# Altium schematic sheet ZYNQ_SOC_FPGA.SchDoc
size A4
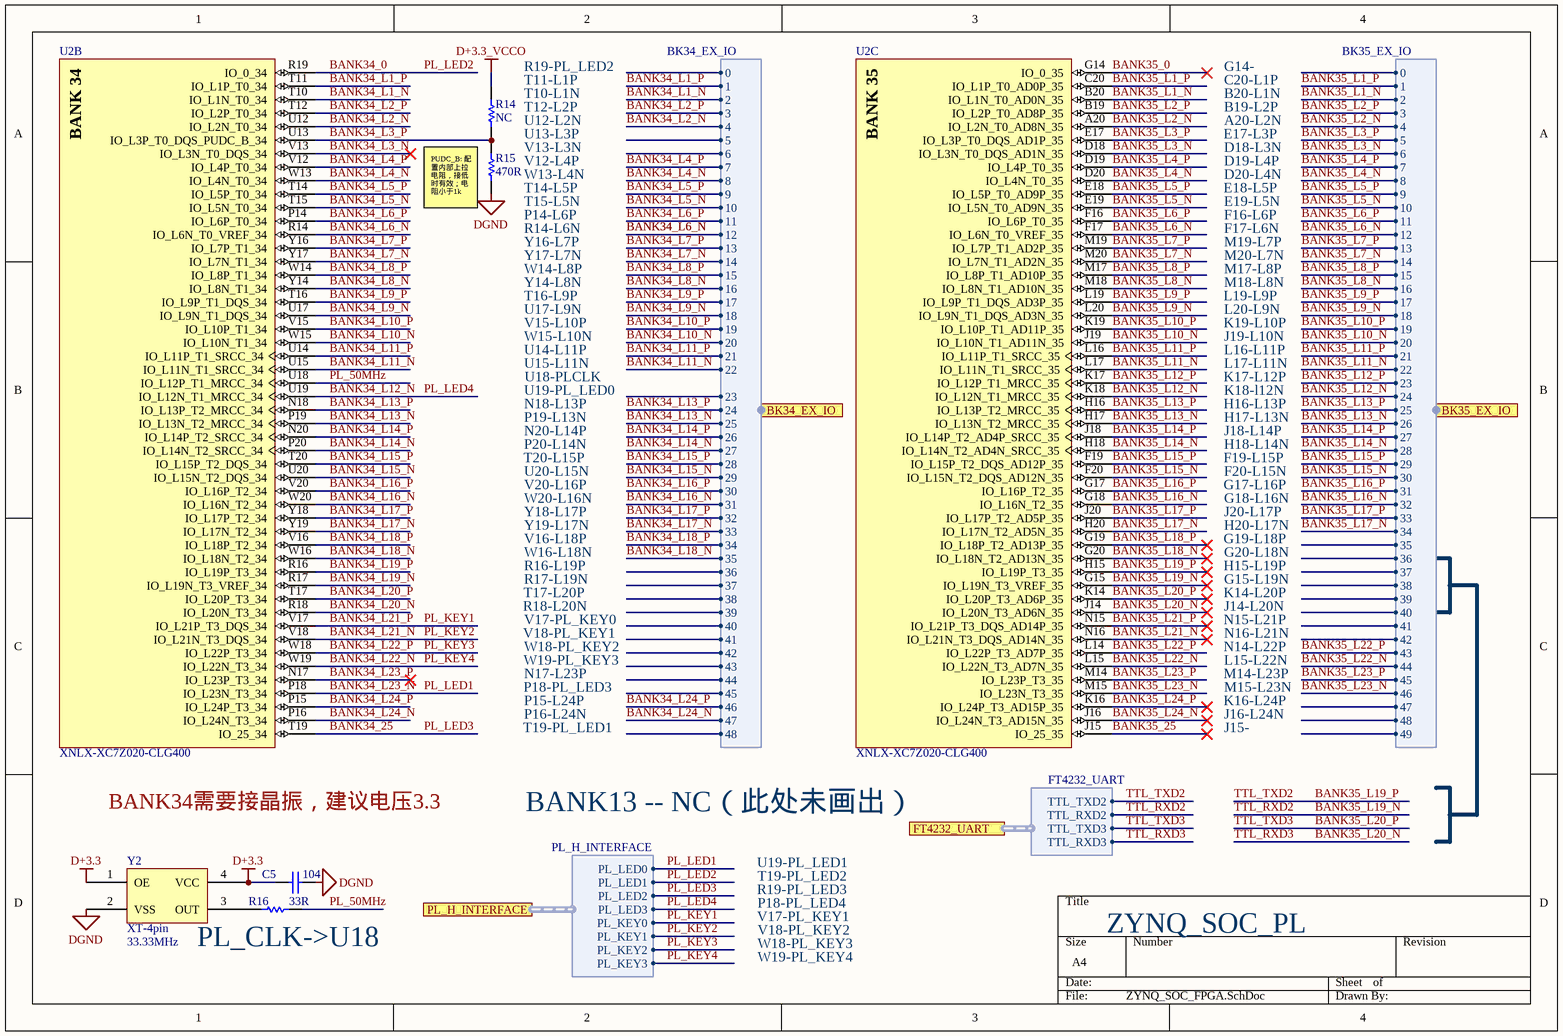
[diagram p0: ZYNQ_SOC_FPGA.SchDoc]

## Parts
C5  104  [C 0402_LL]
R14  NC  [R 0402_L]
R15  470R  [R 0402_L]
R16  33R  [R 0603_L]
U2  XNLX-XC7Z020-CLG400  [BGA400]  (parts B,C of 9)
Y2  XT-4pin  value 33.33MHz  [5032(P)]

## Ports
BK34_EX_IO (harness BK34_EX_IO), BK35_EX_IO (harness BK35_EX_IO), FT4232_UART (harness FT4232_UART), PL_H_INTERFACE (harness PL_H_INTERFACE)

## Harnesses
BK35_EX_IO: 0, 1, 2, 3, 4, 5, 6, 7, 8, 9, 10, 11, 12, 13, 14, 15, 16, 17, 18, 19, 20, 21, 22, 23, 24, 25, 26, 27, 28, 29, 30, 31, 32, 33, 34, 35, 36, 37, 38, 39, 40, 41, 42, 43, 44, 45, 46, 47, 48, 49
BK34_EX_IO: 0, 1, 2, 3, 4, 5, 6, 7, 8, 9, 10, 11, 12, 13, 14, 15, 16, 17, 18, 19, 20, 21, 22, 23, 24, 25, 26, 27, 28, 29, 30, 31, 32, 33, 34, 35, 36, 37, 38, 39, 40, 41, 42, 43, 44, 45, 46, 47, 48
PL_H_INTERFACE: PL_LED0, PL_LED1, PL_KEY0, PL_KEY1, PL_LED2, PL_LED3, PL_KEY2, PL_KEY3
FT4232_UART: TTL_TXD2, TTL_RXD2, TTL_RXD3, TTL_TXD3

## Nets
D+3.3: C5.1 Y2.1(OE) Y2.4(VCC)
D+3.3_VCCO: R14.2
DGND: C5.2 R15.1 Y2.2(VSS)
BANK34_0: U2.R19(IO_0_34) ; port PL_H_INTERFACE.PL_LED1  [also labelled PL_LED2]
BANK34_25: U2.T19(IO_25_34) ; port PL_H_INTERFACE.PL_LED2  [also labelled PL_LED3]
BANK34_L1_N: U2.T10(IO_L1N_T0_34) ; port BK34_EX_IO.2
BANK34_L1_P: U2.T11(IO_L1P_T0_34) ; port BK34_EX_IO.1
BANK34_L2_N: U2.U12(IO_L2N_T0_34) ; port BK34_EX_IO.4
BANK34_L2_P: U2.T12(IO_L2P_T0_34) ; port BK34_EX_IO.3
BANK34_L3_N: U2.V13(IO_L3N_T0_DQS_34)
BANK34_L3_P: R14.1 R15.2 U2.U13(IO_L3P_T0_DQS_PUDC_B_34)
BANK34_L4_N: U2.W13(IO_L4N_T0_34) ; port BK34_EX_IO.8
BANK34_L4_P: U2.V12(IO_L4P_T0_34) ; port BK34_EX_IO.7
BANK34_L5_N: U2.T15(IO_L5N_T0_34) ; port BK34_EX_IO.10
BANK34_L5_P: U2.T14(IO_L5P_T0_34) ; port BK34_EX_IO.9
BANK34_L6_N: U2.R14(IO_L6N_T0_VREF_34) ; port BK34_EX_IO.12
BANK34_L6_P: U2.P14(IO_L6P_T0_34) ; port BK34_EX_IO.11
BANK34_L7_N: U2.Y17(IO_L7N_T1_34) ; port BK34_EX_IO.14
BANK34_L7_P: U2.Y16(IO_L7P_T1_34) ; port BK34_EX_IO.13
BANK34_L8_N: U2.Y14(IO_L8N_T1_34) ; port BK34_EX_IO.16
BANK34_L8_P: U2.W14(IO_L8P_T1_34) ; port BK34_EX_IO.15
BANK34_L9_N: U2.U17(IO_L9N_T1_DQS_34) ; port BK34_EX_IO.18
BANK34_L9_P: U2.T16(IO_L9P_T1_DQS_34) ; port BK34_EX_IO.17
BANK34_L10_N: U2.W15(IO_L10N_T1_34) ; port BK34_EX_IO.20
BANK34_L10_P: U2.V15(IO_L10P_T1_34) ; port BK34_EX_IO.19
BANK34_L11_N: U2.U15(IO_L11N_T1_SRCC_34) ; port BK34_EX_IO.22
BANK34_L11_P: U2.U14(IO_L11P_T1_SRCC_34) ; port BK34_EX_IO.21
BANK34_L12_N: U2.U19(IO_L12N_T1_MRCC_34) ; port PL_H_INTERFACE.PL_LED3  [also labelled PL_LED4]
BANK34_L13_N: U2.P19(IO_L13N_T2_MRCC_34) ; port BK34_EX_IO.25
BANK34_L13_P: U2.N18(IO_L13P_T2_MRCC_34) ; port BK34_EX_IO.24
BANK34_L14_N: U2.P20(IO_L14N_T2_SRCC_34) ; port BK34_EX_IO.27
BANK34_L14_P: U2.N20(IO_L14P_T2_SRCC_34) ; port BK34_EX_IO.26
BANK34_L15_N: U2.U20(IO_L15N_T2_DQS_34) ; port BK34_EX_IO.29
BANK34_L15_P: U2.T20(IO_L15P_T2_DQS_34) ; port BK34_EX_IO.28
BANK34_L16_N: U2.W20(IO_L16N_T2_34) ; port BK34_EX_IO.31
BANK34_L16_P: U2.V20(IO_L16P_T2_34) ; port BK34_EX_IO.30
BANK34_L17_N: U2.Y19(IO_L17N_T2_34) ; port BK34_EX_IO.33
BANK34_L17_P: U2.Y18(IO_L17P_T2_34) ; port BK34_EX_IO.32
BANK34_L18_N: U2.W16(IO_L18N_T2_34) ; port BK34_EX_IO.35
BANK34_L18_P: U2.V16(IO_L18P_T2_34) ; port BK34_EX_IO.34
BANK34_L19_N: U2.R17(IO_L19N_T3_VREF_34)
BANK34_L19_P: U2.R16(IO_L19P_T3_34)
BANK34_L20_N: U2.R18(IO_L20N_T3_34)
BANK34_L20_P: U2.T17(IO_L20P_T3_34)
BANK34_L21_N: U2.V18(IO_L21N_T3_DQS_34) ; port PL_H_INTERFACE.PL_KEY1  [also labelled PL_KEY2]
BANK34_L21_P: U2.V17(IO_L21P_T3_DQS_34) ; port PL_H_INTERFACE.PL_KEY0  [also labelled PL_KEY1]
BANK34_L22_N: U2.W19(IO_L22N_T3_34) ; port PL_H_INTERFACE.PL_KEY3  [also labelled PL_KEY4]
BANK34_L22_P: U2.W18(IO_L22P_T3_34) ; port PL_H_INTERFACE.PL_KEY2  [also labelled PL_KEY3]
BANK34_L23_N: U2.P18(IO_L23N_T3_34) ; port PL_H_INTERFACE.PL_LED0  [also labelled PL_LED1]
BANK34_L23_P: U2.N17(IO_L23P_T3_34)
BANK34_L24_N: U2.P16(IO_L24N_T3_34) ; port BK34_EX_IO.47
BANK34_L24_P: U2.P15(IO_L24P_T3_34) ; port BK34_EX_IO.46
BANK35_0: U2.G14(IO_0_35)
BANK35_25: U2.J15(IO_25_35)
BANK35_L1_N: U2.B20(IO_L1N_T0_AD0N_35) ; port BK35_EX_IO.2
BANK35_L1_P: U2.C20(IO_L1P_T0_AD0P_35) ; port BK35_EX_IO.1
BANK35_L2_N: U2.A20(IO_L2N_T0_AD8N_35) ; port BK35_EX_IO.4
BANK35_L2_P: U2.B19(IO_L2P_T0_AD8P_35) ; port BK35_EX_IO.3
BANK35_L3_N: U2.D18(IO_L3N_T0_DQS_AD1N_35) ; port BK35_EX_IO.6
BANK35_L3_P: U2.E17(IO_L3P_T0_DQS_AD1P_35) ; port BK35_EX_IO.5
BANK35_L4_N: U2.D20(IO_L4N_T0_35) ; port BK35_EX_IO.8
BANK35_L4_P: U2.D19(IO_L4P_T0_35) ; port BK35_EX_IO.7
BANK35_L5_N: U2.E19(IO_L5N_T0_AD9N_35) ; port BK35_EX_IO.10
BANK35_L5_P: U2.E18(IO_L5P_T0_AD9P_35) ; port BK35_EX_IO.9
BANK35_L6_N: U2.F17(IO_L6N_T0_VREF_35) ; port BK35_EX_IO.12
BANK35_L6_P: U2.F16(IO_L6P_T0_35) ; port BK35_EX_IO.11
BANK35_L7_N: U2.M20(IO_L7N_T1_AD2N_35) ; port BK35_EX_IO.14
BANK35_L7_P: U2.M19(IO_L7P_T1_AD2P_35) ; port BK35_EX_IO.13
BANK35_L8_N: U2.M18(IO_L8N_T1_AD10N_35) ; port BK35_EX_IO.16
BANK35_L8_P: U2.M17(IO_L8P_T1_AD10P_35) ; port BK35_EX_IO.15
BANK35_L9_N: U2.L20(IO_L9N_T1_DQS_AD3N_35) ; port BK35_EX_IO.18
BANK35_L9_P: U2.L19(IO_L9P_T1_DQS_AD3P_35) ; port BK35_EX_IO.17
BANK35_L10_N: U2.J19(IO_L10N_T1_AD11N_35) ; port BK35_EX_IO.20
BANK35_L10_P: U2.K19(IO_L10P_T1_AD11P_35) ; port BK35_EX_IO.19
BANK35_L11_N: U2.L17(IO_L11N_T1_SRCC_35) ; port BK35_EX_IO.22
BANK35_L11_P: U2.L16(IO_L11P_T1_SRCC_35) ; port BK35_EX_IO.21
BANK35_L12_N: U2.K18(IO_L12N_T1_MRCC_35) ; port BK35_EX_IO.24
BANK35_L12_P: U2.K17(IO_L12P_T1_MRCC_35) ; port BK35_EX_IO.23
BANK35_L13_N: U2.H17(IO_L13N_T2_MRCC_35) ; port BK35_EX_IO.26
BANK35_L13_P: U2.H16(IO_L13P_T2_MRCC_35) ; port BK35_EX_IO.25
BANK35_L14_N: U2.H18(IO_L14N_T2_AD4N_SRCC_35) ; port BK35_EX_IO.28
BANK35_L14_P: U2.J18(IO_L14P_T2_AD4P_SRCC_35) ; port BK35_EX_IO.27
BANK35_L15_N: U2.F20(IO_L15N_T2_DQS_AD12N_35) ; port BK35_EX_IO.30
BANK35_L15_P: U2.F19(IO_L15P_T2_DQS_AD12P_35) ; port BK35_EX_IO.29
BANK35_L16_N: U2.G18(IO_L16N_T2_35) ; port BK35_EX_IO.32
BANK35_L16_P: U2.G17(IO_L16P_T2_35) ; port BK35_EX_IO.31
BANK35_L17_N: U2.H20(IO_L17N_T2_AD5N_35) ; port BK35_EX_IO.34
BANK35_L17_P: U2.J20(IO_L17P_T2_AD5P_35) ; port BK35_EX_IO.33
BANK35_L18_N: U2.G20(IO_L18N_T2_AD13N_35)
BANK35_L18_P: U2.G19(IO_L18P_T2_AD13P_35)
BANK35_L19_N: U2.G15(IO_L19N_T3_VREF_35) ; port FT4232_UART.TTL_RXD2  [also labelled TTL_RXD2]
BANK35_L19_P: U2.H15(IO_L19P_T3_35) ; port FT4232_UART.TTL_TXD2  [also labelled TTL_TXD2]
BANK35_L20_N: U2.J14(IO_L20N_T3_AD6N_35) ; port FT4232_UART.TTL_RXD3  [also labelled TTL_RXD3]
BANK35_L20_P: U2.K14(IO_L20P_T3_AD6P_35) ; port FT4232_UART.TTL_TXD3  [also labelled TTL_TXD3]
BANK35_L21_N: U2.N16(IO_L21N_T3_DQS_AD14N_35)
BANK35_L21_P: U2.N15(IO_L21P_T3_DQS_AD14P_35)
BANK35_L22_N: U2.L15(IO_L22N_T3_AD7N_35) ; port BK35_EX_IO.44
BANK35_L22_P: U2.L14(IO_L22P_T3_AD7P_35) ; port BK35_EX_IO.43
BANK35_L23_N: U2.M15(IO_L23N_T3_35) ; port BK35_EX_IO.46
BANK35_L23_P: U2.M14(IO_L23P_T3_35) ; port BK35_EX_IO.45
BANK35_L24_N: U2.J16(IO_L24N_T3_AD15N_35)
BANK35_L24_P: U2.K16(IO_L24P_T3_AD15P_35)
PL_50MHz: R16.2 U2.U18(IO_L12P_T1_MRCC_34)
NetR16_1: R16.1 Y2.3(OUT)

## Notes on the sheet
- (near R14) T11-L1P
- T12-L2P
- (near R14) T10-L1N
- U12-L2N
- (near R14) R19-PL_LED2
- G14-
- B19-L2P
- C20-L1P
- B20-L1N
- A20-L2N
- V12-L4P
- U13-L3P
- V13-L3N
- W13-L4N
- E17-L3P
- D19-L4P
- D18-L3N
- D20-L4N
- (near R15) PUDC_B: 配置内部上拉电阻，接低时有效；电阻小于1k
- (near R15) P14-L6P
- (near R15) T14-L5P
- Y16-L7P
- (near R15) T15-L5N
- (near R15) R14-L6N
- Y17-L7N
- F16-L6P
- E18-L5P
- F17-L6N
- E19-L5N
- M19-L7P
- M20-L7N
- T16-L9P
- Y14-L8N
- U17-L9N
- W14-L8P
- L19-L9P
- L20-L9N
- M17-L8P
- M18-L8N
- V15-L10P
- U14-L11P
- U15-L11N
- W15-L10N
- U18-PLCLK
- U19-PL_LED0
- J19-L10N
- K18-l12N
- L16-L11P
- K19-L10P
- K17-L12P
- L17-L11N
- N18-L13P
- N20-L14P
- P19-L13N
- P20-L14N
- J18-L14P
- H16-L13P
- H17-L13N
- H18-L14N
- T20-L15P
- V20-L16P
- Y18-L17P
- U20-L15N
- Y19-L17N
- W20-L16N
- J20-L17P
- F19-L15P
- G17-L16P
- F20-L15N
- G18-L16N
- H20-L17N
- R16-L19P
- V16-L18P
- R17-L19N
- W16-L18N
- G19-L18P
- H15-L19P
- G20-L18N
- G15-L19N
- T17-L20P
- R18-L20N
- V18-PL_KEY1
- V17-PL_KEY0
- W19-PL_KEY3
- W18-PL_KEY2
- J14-L20N
- K14-L20P
- N15-L21P
- N14-L22P
- L15-L22N
- N16-L21N
- P15-L24P
- N17-L23P
- P16-L24N
- P18-PL_LED3
- J16-L24N
- K16-L24P
- M14-L23P
- M15-L23N
- T19-PL_LED1
- J15-
- BANK34需要接晶振，建议电压3.3
- BANK13 -- NC（此处未画出）
- P18-PL_LED4
- T19-PL_LED2
- R19-PL_LED3
- U19-PL_LED1
- V17-PL_KEY1
- V18-PL_KEY2
- ZYNQ_SOC_PL
- PL_CLK->U18
- W18-PL_KEY3
- W19-PL_KEY4
- (in symbol XNLX-XC7Z020-CLG400, part B) BANK 34
- (in symbol XNLX-XC7Z020-CLG400, part C) BANK 35

## Library data of the parts
C5 = Cap: Capacitor; Published: 8-Jun-2000; LatestRevisionDate: 17-Jul-2002; LatestRevisionNote: Re-released for DXP Platform.; PackageReference: RAD-0.3; Publisher: Altium Limited; PackageDescription: Radial Cap, Thru-Hole; 2 Leads; 0.3 in Pin Spacing
R14-R16 = Res1: Resistor; Value: 1K; Published: 8-Jun-2000; LatestRevisionDate: 17-Jul-2002; LatestRevisionNote: Re-released for DXP Platform.; PackageReference: AXIAL-0.3; Publisher: Altium Limited; PackageDescription: Axial Device, Thru-Hole; 2 Leads; 0.3 in Pin Spacing
U2 = XNLX-XC7Z020-CLG400: xilinx双核A9处理器与FPGA集成的SoC; Manufacturer: xilinx; value: NC
Y2 = XT-4pin: 有源晶振; Manufacturer: NC